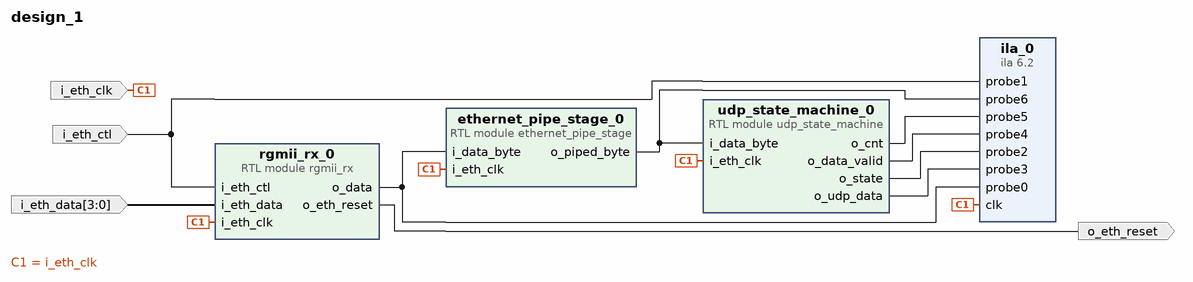
[diagram p0: block diagram of the top level]
# Vivado block design design_1, xc7a200tfbg484-2, Vivado 2025.1
create_bd_design design_1

create_bd_port -dir I -from 3 -to 0 i_eth_data
create_bd_port -dir I i_eth_ctl
create_bd_port -dir O -type rst o_eth_reset
create_bd_port -dir I -type clk i_eth_clk

create_bd_cell -type module -reference rgmii_rx rgmii_rx_0
create_bd_cell -type ip -vlnv xilinx.com:ip:ila:6.2 ila_0
set_property -dict [list \
  CONFIG.C_DATA_DEPTH 2048 \
  CONFIG.C_MONITOR_TYPE Native \
  CONFIG.C_NUM_OF_PROBES 7 \
  CONFIG.C_PROBE0_TYPE 1 \
  CONFIG.C_PROBE0_WIDTH 8 \
  CONFIG.C_PROBE1_TYPE 1 \
  CONFIG.C_PROBE1_WIDTH 1 \
  CONFIG.C_PROBE2_TYPE 1 \
  CONFIG.C_PROBE2_WIDTH 5 \
  CONFIG.C_PROBE3_TYPE 1 \
  CONFIG.C_PROBE3_WIDTH 8 \
  CONFIG.C_PROBE4_TYPE 1 \
  CONFIG.C_PROBE4_WIDTH 1 \
  CONFIG.C_PROBE5_TYPE 1 \
  CONFIG.C_PROBE5_WIDTH 16 \
  CONFIG.C_PROBE6_TYPE 1 \
  CONFIG.C_PROBE6_WIDTH 8 \
] [get_bd_cells ila_0]
create_bd_cell -type module -reference ethernet_pipe_stage ethernet_pipe_stage_0
create_bd_cell -type module -reference udp_state_machine udp_state_machine_0

# ---- connections ----

connect_bd_net [get_bd_ports i_eth_ctl] [get_bd_pins ila_0/probe1] [get_bd_pins rgmii_rx_0/i_eth_ctl]
connect_bd_net [get_bd_pins ethernet_pipe_stage_0/o_piped_byte] [get_bd_pins udp_state_machine_0/i_data_byte] [get_bd_pins ila_0/probe6]
connect_bd_net [get_bd_ports i_eth_clk] \
  [get_bd_pins ila_0/clk] [get_bd_pins rgmii_rx_0/i_eth_clk] [get_bd_pins udp_state_machine_0/i_eth_clk] \
  [get_bd_pins ethernet_pipe_stage_0/i_eth_clk]
connect_bd_net -net i_eth_data_0_1 [get_bd_ports i_eth_data] [get_bd_pins rgmii_rx_0/i_eth_data]
connect_bd_net [get_bd_pins rgmii_rx_0/o_data] [get_bd_pins ethernet_pipe_stage_0/i_data_byte] [get_bd_pins ila_0/probe0]
connect_bd_net [get_bd_pins rgmii_rx_0/o_eth_reset] [get_bd_ports o_eth_reset]
connect_bd_net [get_bd_pins udp_state_machine_0/o_cnt] [get_bd_pins ila_0/probe5]
connect_bd_net [get_bd_pins udp_state_machine_0/o_data_valid] [get_bd_pins ila_0/probe4]
connect_bd_net [get_bd_pins udp_state_machine_0/o_state] [get_bd_pins ila_0/probe2]
connect_bd_net [get_bd_pins udp_state_machine_0/o_udp_data] [get_bd_pins ila_0/probe3]

validate_bd_design
save_bd_design
